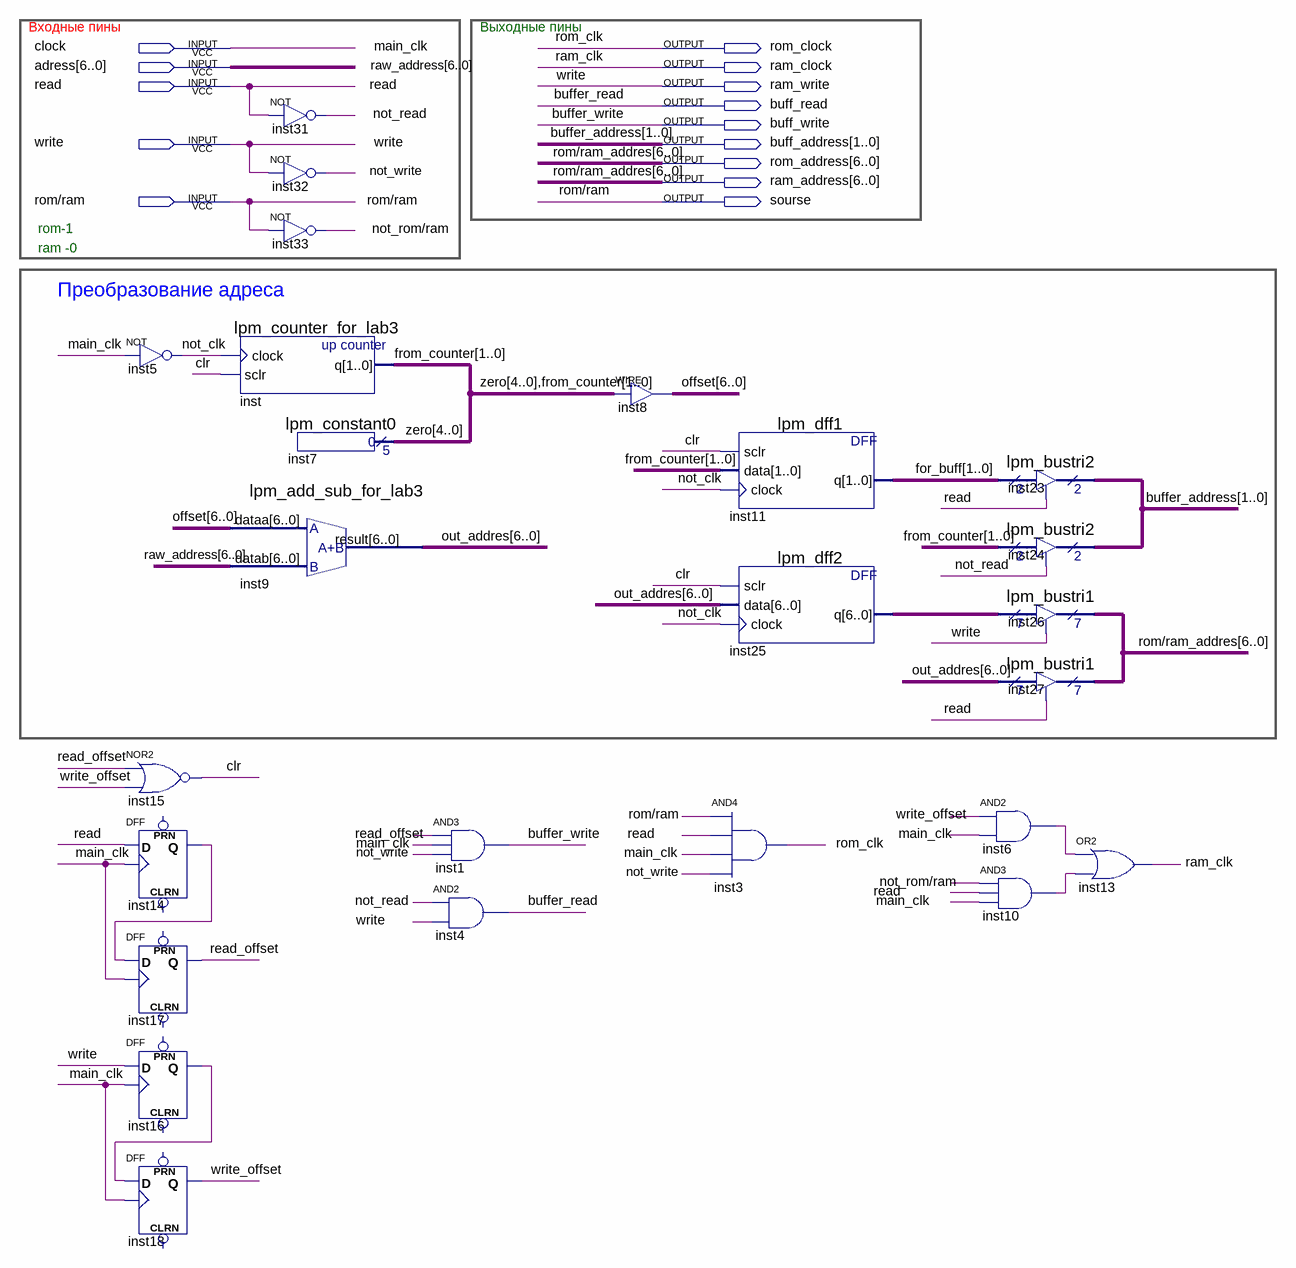
[diagram p0: schematic sheet]
// Quartus schematic IO_controller.bdf as structural Verilog: 25 symbols, 14 pins
module IO_controller (
  input  clock,
  input  [6:0] adress,
  input  read,
  input  write,
  input  \rom/ram ,
  output rom_clock,
  output ram_clock,
  output ram_write,
  output buff_read,
  output buff_write,
  output [1:0] buff_address,
  output [6:0] rom_address,
  output [6:0] ram_address,
  output sourse
);

  wire clr, inst6_out, inst10_out, inst14_q, inst16_q, not_clk, not_read, \not_rom/ram , not_write,
       read_offset, write_offset;
  wire [1:0] for_buff, from_counter;
  wire [4:0] zero;
  wire [6:0] inst25_q, offset, out_addres;

  not inst5 (not_clk, clock);
  nor inst15 (clr, read_offset, write_offset);
  DFF inst14 (.CLK(clock), .D(read), .Q(inst14_q));  // open: CLRN, PRN
  DFF inst17 (.CLK(clock), .D(inst14_q), .Q(read_offset));  // open: CLRN, PRN
  DFF inst16 (.CLK(clock), .D(write), .Q(inst16_q));  // open: CLRN, PRN
  DFF inst18 (.CLK(clock), .D(inst16_q), .Q(write_offset));  // open: CLRN, PRN
  lpm_counter_for_lab3 inst (.sclr(clr), .clock(not_clk), .q(from_counter));
  lpm_add_sub_for_lab3 inst9 (.dataa(offset), .datab(adress), .result(out_addres));
  not inst31 (not_read, read);
  not inst32 (not_write, write);
  not inst33 (\not_rom/ram , \rom/ram );
  lpm_constant0 inst7 (.result(zero));
  and inst1 (buff_write, read_offset, clock, not_write);
  and inst4 (buff_read, not_read, write);
  assign offset = {zero, from_counter};  // WIRE inst8
  lpm_dff1 inst11 (.sclr(clr), .data(from_counter), .clock(not_clk), .q(for_buff));
  lpm_dff2 inst25 (.sclr(clr), .data(out_addres), .clock(not_clk), .q(inst25_q));
  and inst3 (rom_clock, \rom/ram , read, clock, not_write);
  lpm_bustri2 inst23 (.enabledt(read), .data(for_buff), .tridata(buff_address));
  lpm_bustri2 inst24 (.enabledt(not_read), .data(from_counter), .tridata(buff_address));
  lpm_bustri1 inst26 (.enabledt(write), .data(inst25_q), .tridata(ram_address));
  lpm_bustri1 inst27 (.enabledt(read), .data(out_addres), .tridata(ram_address));
  and inst6 (inst6_out, write_offset, clock);
  and inst10 (inst10_out, \not_rom/ram , read, clock);
  or inst13 (ram_clock, inst6_out, inst10_out);

  assign ram_write = write;
  assign rom_address = ram_address;
  assign sourse = \rom/ram ;

  // Other names for the same wires on the sheet: buffer_address[1:0] = buff_address; buffer_read = buff_read;
  //   buffer_write = buff_write; main_clk = clock; ram_clk = ram_clock; raw_address[6:0] = adress;
  //   rom/ram_addres[6:0] = ram_address; rom_clk = rom_clock

  // Notes on the sheet:
  //   Входные пины
  //   Выходные пины
  //   rom-1
  //   ram -0
  //   Преобразование адреса
endmodule
